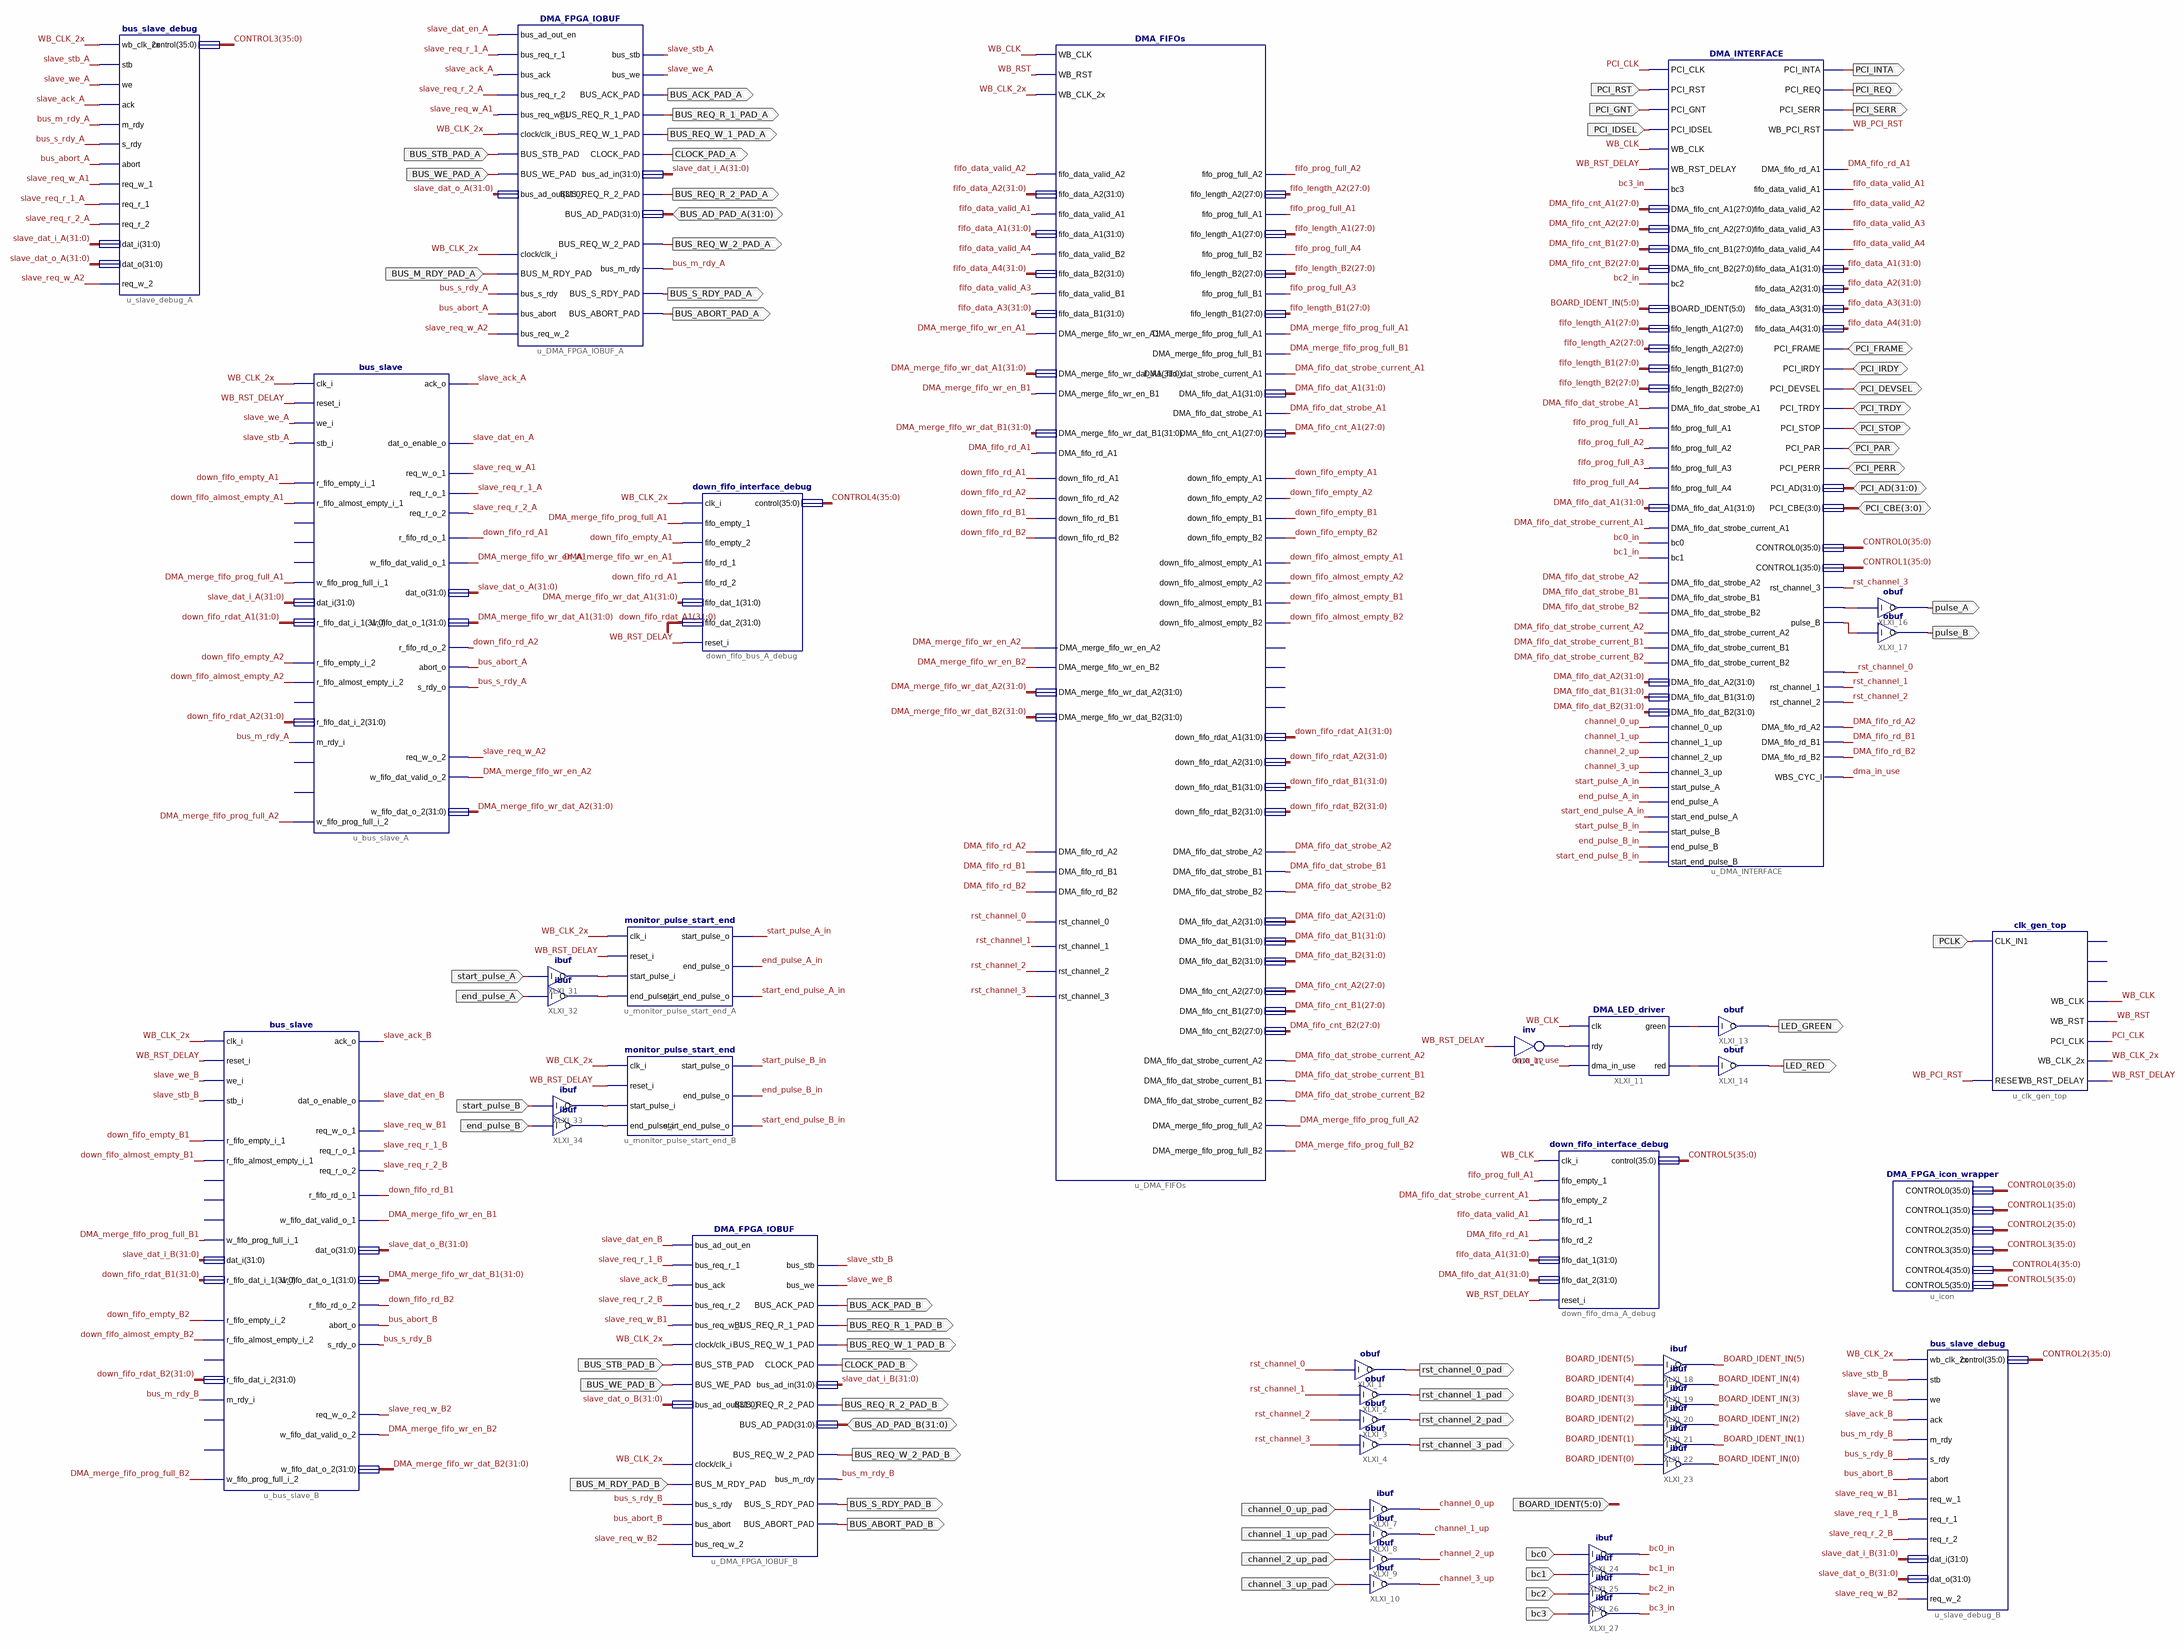
[diagram p0: schematic sheet 1]
// Xilinx ISE schematic DMA_FPGA.sch (spartan6) as structural Verilog: 42 symbols, 61 ports
module DMA_FPGA (
  input  BUS_STB_PAD_A,
  input  BUS_WE_PAD_A,
  input  BUS_M_RDY_PAD_A,
  input  BUS_STB_PAD_B,
  input  BUS_WE_PAD_B,
  input  BUS_M_RDY_PAD_B,
  input  PCI_RST,
  input  PCI_GNT,
  input  PCI_IDSEL,
  input  channel_0_up_pad,
  input  channel_1_up_pad,
  input  channel_2_up_pad,
  input  channel_3_up_pad,
  input  [5:0] BOARD_IDENT,
  input  bc0,
  input  bc1,
  input  bc2,
  input  bc3,
  input  PCLK,
  input  start_pulse_A,
  input  end_pulse_A,
  input  start_pulse_B,
  input  end_pulse_B,
  inout  [31:0] BUS_AD_PAD_A,
  inout  [31:0] BUS_AD_PAD_B,
  inout  PCI_FRAME,
  inout  PCI_IRDY,
  inout  PCI_DEVSEL,
  inout  PCI_TRDY,
  inout  PCI_STOP,
  inout  PCI_PAR,
  inout  PCI_PERR,
  inout  [31:0] PCI_AD,
  inout  [3:0] PCI_CBE,
  output BUS_ACK_PAD_A,
  output BUS_REQ_W_1_PAD_A,
  output CLOCK_PAD_A,
  output BUS_REQ_R_1_PAD_A,
  output BUS_REQ_R_2_PAD_A,
  output BUS_S_RDY_PAD_A,
  output BUS_ABORT_PAD_A,
  output BUS_ACK_PAD_B,
  output BUS_REQ_W_1_PAD_B,
  output CLOCK_PAD_B,
  output BUS_REQ_R_1_PAD_B,
  output BUS_REQ_R_2_PAD_B,
  output BUS_S_RDY_PAD_B,
  output BUS_ABORT_PAD_B,
  output BUS_REQ_W_2_PAD_A,
  output BUS_REQ_W_2_PAD_B,
  output PCI_INTA,
  output PCI_REQ,
  output PCI_SERR,
  output pulse_A,
  output pulse_B,
  output rst_channel_0_pad,
  output rst_channel_1_pad,
  output rst_channel_2_pad,
  output rst_channel_3_pad,
  output LED_GREEN,
  output LED_RED
);

  wire bc0_in, bc1_in, bc2_in, bc3_in, bus_abort_A, bus_abort_B, bus_m_rdy_A, bus_m_rdy_B, bus_s_rdy_A,
       bus_s_rdy_B, channel_0_up, channel_1_up, channel_2_up, channel_3_up, DMA_fifo_dat_strobe_A1,
       DMA_fifo_dat_strobe_A2, DMA_fifo_dat_strobe_B1, DMA_fifo_dat_strobe_B2,
       DMA_fifo_dat_strobe_current_A1, DMA_fifo_dat_strobe_current_A2, DMA_fifo_dat_strobe_current_B1,
       DMA_fifo_dat_strobe_current_B2, DMA_fifo_rd_A1, DMA_fifo_rd_A2, DMA_fifo_rd_B1, DMA_fifo_rd_B2,
       dma_in_use, DMA_merge_fifo_prog_full_A1, DMA_merge_fifo_prog_full_A2, DMA_merge_fifo_prog_full_B1,
       DMA_merge_fifo_prog_full_B2, DMA_merge_fifo_wr_en_A1, DMA_merge_fifo_wr_en_A2,
       DMA_merge_fifo_wr_en_B1, DMA_merge_fifo_wr_en_B2, down_fifo_almost_empty_A1,
       down_fifo_almost_empty_A2, down_fifo_almost_empty_B1, down_fifo_almost_empty_B2, down_fifo_empty_A1,
       down_fifo_empty_A2, down_fifo_empty_B1, down_fifo_empty_B2, down_fifo_rd_A1, down_fifo_rd_A2,
       down_fifo_rd_B1, down_fifo_rd_B2, end_pulse_A_in, end_pulse_B_in, fifo_data_valid_A1,
       fifo_data_valid_A2, fifo_data_valid_A3, fifo_data_valid_A4, fifo_prog_full_A1, fifo_prog_full_A2,
       fifo_prog_full_A3, fifo_prog_full_A4, LED_GREENX, PCI_CLK, rst_channel_0, rst_channel_1,
       rst_channel_2, rst_channel_3, slave_ack_A, slave_ack_B, slave_dat_en_A, slave_dat_en_B,
       slave_req_r_1_A, slave_req_r_1_B, slave_req_r_2_A, slave_req_r_2_B, slave_req_w_A1, slave_req_w_A2,
       slave_req_w_B1, slave_req_w_B2, slave_stb_A, slave_stb_B, slave_we_A, slave_we_B,
       start_end_pulse_A_in, start_end_pulse_B_in, start_pulse_A_in, start_pulse_B_in, WB_CLK, WB_CLK_2x,
       WB_PCI_RST, WB_RST, WB_RST_DELAY, XLXN_7, XLXN_11, XLXN_14, XLXN_15, XLXN_21, XLXN_23, XLXN_24,
       XLXN_25;
  wire [5:0] BOARD_IDENT_IN;
  wire [27:0] DMA_fifo_cnt_A1, DMA_fifo_cnt_A2, DMA_fifo_cnt_B1, DMA_fifo_cnt_B2, fifo_length_A1,
       fifo_length_A2, fifo_length_B1, fifo_length_B2;
  wire [31:0] DMA_fifo_dat_A1, DMA_fifo_dat_A2, DMA_fifo_dat_B1, DMA_fifo_dat_B2, DMA_merge_fifo_wr_dat_A1,
       DMA_merge_fifo_wr_dat_A2, DMA_merge_fifo_wr_dat_B1, DMA_merge_fifo_wr_dat_B2, down_fifo_rdat_A1,
       down_fifo_rdat_A2, down_fifo_rdat_B1, down_fifo_rdat_B2, fifo_data_A1, fifo_data_A2, fifo_data_A3,
       fifo_data_A4, slave_dat_i_A, slave_dat_i_B, slave_dat_o_A, slave_dat_o_B;
  wire [35:0] CONTROL0, CONTROL1, CONTROL2, CONTROL3, CONTROL4, CONTROL5;

  bus_slave u_bus_slave_A (
    .clk_i(WB_CLK_2x), .reset_i(WB_RST_DELAY), .we_i(slave_we_A), .stb_i(slave_stb_A),
    .r_fifo_empty_i_1(down_fifo_empty_A1), .r_fifo_almost_empty_i_1(down_fifo_almost_empty_A1),
    .w_fifo_prog_full_i_1(DMA_merge_fifo_prog_full_A1), .dat_i(slave_dat_i_A),
    .r_fifo_dat_i_1(down_fifo_rdat_A1), .ack_o(slave_ack_A), .dat_o_enable_o(slave_dat_en_A),
    .req_w_o_1(slave_req_w_A1), .w_fifo_dat_valid_o_1(DMA_merge_fifo_wr_en_A1), .dat_o(slave_dat_o_A),
    .w_fifo_dat_o_1(DMA_merge_fifo_wr_dat_A1), .req_r_o_1(slave_req_r_1_A), .req_r_o_2(slave_req_r_2_A),
    .r_fifo_rd_o_1(down_fifo_rd_A1), .r_fifo_rd_o_2(down_fifo_rd_A2), .r_fifo_empty_i_2(down_fifo_empty_A2),
    .r_fifo_almost_empty_i_2(down_fifo_almost_empty_A2), .r_fifo_dat_i_2(down_fifo_rdat_A2),
    .abort_o(bus_abort_A), .s_rdy_o(bus_s_rdy_A), .m_rdy_i(bus_m_rdy_A),
    .w_fifo_prog_full_i_2(DMA_merge_fifo_prog_full_A2), .w_fifo_dat_valid_o_2(DMA_merge_fifo_wr_en_A2),
    .w_fifo_dat_o_2(DMA_merge_fifo_wr_dat_A2), .req_w_o_2(slave_req_w_A2));  // open: r_fifo_prog_empty_i_1, w_fifo_full_i_1, w_fifo_almost_full_i_1, r_fifo_prog_empty_i_2, w_fifo_full_i_2, w_fifo_almost_full_i_2
  DMA_FPGA_IOBUF u_DMA_FPGA_IOBUF_A (
    .bus_ad_out_en(slave_dat_en_A), .bus_ack(slave_ack_A), .bus_req_w_1(slave_req_w_A1), .clock(WB_CLK_2x),
    .BUS_STB_PAD(BUS_STB_PAD_A), .BUS_WE_PAD(BUS_WE_PAD_A), .bus_ad_out(slave_dat_o_A),
    .bus_stb(slave_stb_A), .bus_we(slave_we_A), .BUS_ACK_PAD(BUS_ACK_PAD_A),
    .BUS_REQ_R_1_PAD(BUS_REQ_R_1_PAD_A), .BUS_REQ_W_1_PAD(BUS_REQ_W_1_PAD_A), .CLOCK_PAD(CLOCK_PAD_A),
    .bus_ad_in(slave_dat_i_A), .BUS_REQ_R_2_PAD(BUS_REQ_R_2_PAD_A), .BUS_AD_PAD(BUS_AD_PAD_A),
    .bus_req_r_1(slave_req_r_1_A), .bus_req_r_2(slave_req_r_2_A), .clk_i(WB_CLK_2x),
    .BUS_M_RDY_PAD(BUS_M_RDY_PAD_A), .bus_s_rdy(bus_s_rdy_A), .bus_abort(bus_abort_A),
    .bus_m_rdy(bus_m_rdy_A), .BUS_S_RDY_PAD(BUS_S_RDY_PAD_A), .BUS_ABORT_PAD(BUS_ABORT_PAD_A),
    .BUS_REQ_W_2_PAD(BUS_REQ_W_2_PAD_A), .bus_req_w_2(slave_req_w_A2));
  bus_slave_debug u_slave_debug_A (
    .wb_clk_2x(WB_CLK_2x), .stb(slave_stb_A), .we(slave_we_A), .ack(slave_ack_A), .m_rdy(bus_m_rdy_A),
    .s_rdy(bus_s_rdy_A), .abort(bus_abort_A), .req_w_1(slave_req_w_A1), .req_r_1(slave_req_r_1_A),
    .req_r_2(slave_req_r_2_A), .dat_i(slave_dat_i_A), .dat_o(slave_dat_o_A), .control(CONTROL3),
    .req_w_2(slave_req_w_A2));
  DMA_FIFOs u_DMA_FIFOs (
    .WB_CLK(WB_CLK), .WB_RST(WB_RST), .WB_CLK_2x(WB_CLK_2x), .fifo_data_valid_A2(fifo_data_valid_A2),
    .fifo_data_A2(fifo_data_A2), .fifo_data_valid_A1(fifo_data_valid_A1), .fifo_data_A1(fifo_data_A1),
    .fifo_data_valid_B2(fifo_data_valid_A4), .fifo_data_B2(fifo_data_A4),
    .fifo_data_valid_B1(fifo_data_valid_A3), .fifo_data_B1(fifo_data_A3),
    .DMA_merge_fifo_wr_en_A1(DMA_merge_fifo_wr_en_A1), .DMA_merge_fifo_wr_dat_A1(DMA_merge_fifo_wr_dat_A1),
    .DMA_merge_fifo_wr_en_B1(DMA_merge_fifo_wr_en_B1), .DMA_merge_fifo_wr_dat_B1(DMA_merge_fifo_wr_dat_B1),
    .DMA_fifo_rd_A1(DMA_fifo_rd_A1), .fifo_prog_full_A2(fifo_prog_full_A2), .fifo_length_A2(fifo_length_A2),
    .fifo_prog_full_A1(fifo_prog_full_A1), .fifo_length_A1(fifo_length_A1),
    .fifo_prog_full_B2(fifo_prog_full_A4), .fifo_length_B2(fifo_length_B2),
    .fifo_prog_full_B1(fifo_prog_full_A3), .fifo_length_B1(fifo_length_B1),
    .DMA_merge_fifo_prog_full_A1(DMA_merge_fifo_prog_full_A1),
    .DMA_merge_fifo_prog_full_B1(DMA_merge_fifo_prog_full_B1),
    .DMA_fifo_dat_strobe_current_A1(DMA_fifo_dat_strobe_current_A1), .DMA_fifo_dat_A1(DMA_fifo_dat_A1),
    .DMA_fifo_dat_strobe_A1(DMA_fifo_dat_strobe_A1), .DMA_fifo_cnt_A1(DMA_fifo_cnt_A1),
    .down_fifo_empty_A1(down_fifo_empty_A1), .down_fifo_empty_A2(down_fifo_empty_A2),
    .down_fifo_empty_B2(down_fifo_empty_B2), .down_fifo_almost_empty_A1(down_fifo_almost_empty_A1),
    .down_fifo_almost_empty_A2(down_fifo_almost_empty_A2),
    .down_fifo_almost_empty_B1(down_fifo_almost_empty_B1),
    .down_fifo_almost_empty_B2(down_fifo_almost_empty_B2), .down_fifo_empty_B1(down_fifo_empty_B1),
    .down_fifo_rdat_A1(down_fifo_rdat_A1), .down_fifo_rdat_A2(down_fifo_rdat_A2),
    .down_fifo_rdat_B1(down_fifo_rdat_B1), .down_fifo_rdat_B2(down_fifo_rdat_B2),
    .down_fifo_rd_A1(down_fifo_rd_A1), .down_fifo_rd_A2(down_fifo_rd_A2), .down_fifo_rd_B1(down_fifo_rd_B1),
    .down_fifo_rd_B2(down_fifo_rd_B2), .DMA_fifo_dat_strobe_A2(DMA_fifo_dat_strobe_A2),
    .DMA_fifo_dat_strobe_B1(DMA_fifo_dat_strobe_B1), .DMA_fifo_dat_strobe_B2(DMA_fifo_dat_strobe_B2),
    .DMA_fifo_dat_A2(DMA_fifo_dat_A2), .DMA_fifo_dat_B1(DMA_fifo_dat_B1), .DMA_fifo_dat_B2(DMA_fifo_dat_B2),
    .DMA_fifo_cnt_A2(DMA_fifo_cnt_A2), .DMA_fifo_cnt_B1(DMA_fifo_cnt_B1), .DMA_fifo_cnt_B2(DMA_fifo_cnt_B2),
    .DMA_fifo_dat_strobe_current_A2(DMA_fifo_dat_strobe_current_A2),
    .DMA_fifo_dat_strobe_current_B1(DMA_fifo_dat_strobe_current_B1),
    .DMA_fifo_dat_strobe_current_B2(DMA_fifo_dat_strobe_current_B2), .DMA_fifo_rd_A2(DMA_fifo_rd_A2),
    .DMA_fifo_rd_B1(DMA_fifo_rd_B1), .DMA_fifo_rd_B2(DMA_fifo_rd_B2),
    .DMA_merge_fifo_wr_en_A2(DMA_merge_fifo_wr_en_A2), .DMA_merge_fifo_wr_en_B2(DMA_merge_fifo_wr_en_B2),
    .DMA_merge_fifo_wr_dat_A2(DMA_merge_fifo_wr_dat_A2), .DMA_merge_fifo_wr_dat_B2(DMA_merge_fifo_wr_dat_B2),
    .DMA_merge_fifo_prog_full_A2(DMA_merge_fifo_prog_full_A2),
    .DMA_merge_fifo_prog_full_B2(DMA_merge_fifo_prog_full_B2), .rst_channel_0(rst_channel_0),
    .rst_channel_1(rst_channel_1), .rst_channel_2(rst_channel_2), .rst_channel_3(rst_channel_3));  // open: down_fifo_prog_empty_A1, down_fifo_prog_empty_A2, down_fifo_prog_empty_B1, down_fifo_prog_empty_B2
  DMA_FPGA_IOBUF u_DMA_FPGA_IOBUF_B (
    .bus_ad_out_en(slave_dat_en_B), .bus_ack(slave_ack_B), .bus_req_w_1(slave_req_w_B1), .clock(WB_CLK_2x),
    .BUS_STB_PAD(BUS_STB_PAD_B), .BUS_WE_PAD(BUS_WE_PAD_B), .bus_ad_out(slave_dat_o_B),
    .bus_stb(slave_stb_B), .bus_we(slave_we_B), .BUS_ACK_PAD(BUS_ACK_PAD_B),
    .BUS_REQ_R_1_PAD(BUS_REQ_R_1_PAD_B), .BUS_REQ_W_1_PAD(BUS_REQ_W_1_PAD_B), .CLOCK_PAD(CLOCK_PAD_B),
    .bus_ad_in(slave_dat_i_B), .BUS_REQ_R_2_PAD(BUS_REQ_R_2_PAD_B), .BUS_AD_PAD(BUS_AD_PAD_B),
    .bus_req_r_1(slave_req_r_1_B), .bus_req_r_2(slave_req_r_2_B), .clk_i(WB_CLK_2x),
    .BUS_M_RDY_PAD(BUS_M_RDY_PAD_B), .bus_s_rdy(bus_s_rdy_B), .bus_abort(bus_abort_B),
    .bus_m_rdy(bus_m_rdy_B), .BUS_S_RDY_PAD(BUS_S_RDY_PAD_B), .BUS_ABORT_PAD(BUS_ABORT_PAD_B),
    .BUS_REQ_W_2_PAD(BUS_REQ_W_2_PAD_B), .bus_req_w_2(slave_req_w_B2));
  bus_slave u_bus_slave_B (
    .clk_i(WB_CLK_2x), .reset_i(WB_RST_DELAY), .we_i(slave_we_B), .stb_i(slave_stb_B),
    .r_fifo_empty_i_1(down_fifo_empty_B1), .r_fifo_almost_empty_i_1(down_fifo_almost_empty_B1),
    .w_fifo_prog_full_i_1(DMA_merge_fifo_prog_full_B1), .dat_i(slave_dat_i_B),
    .r_fifo_dat_i_1(down_fifo_rdat_B1), .ack_o(slave_ack_B), .dat_o_enable_o(slave_dat_en_B),
    .req_w_o_1(slave_req_w_B1), .w_fifo_dat_valid_o_1(DMA_merge_fifo_wr_en_B1), .dat_o(slave_dat_o_B),
    .w_fifo_dat_o_1(DMA_merge_fifo_wr_dat_B1), .req_r_o_1(slave_req_r_1_B), .req_r_o_2(slave_req_r_2_B),
    .r_fifo_rd_o_1(down_fifo_rd_B1), .r_fifo_rd_o_2(down_fifo_rd_B2), .r_fifo_empty_i_2(down_fifo_empty_B2),
    .r_fifo_almost_empty_i_2(down_fifo_almost_empty_B2), .r_fifo_dat_i_2(down_fifo_rdat_B2),
    .abort_o(bus_abort_B), .s_rdy_o(bus_s_rdy_B), .m_rdy_i(bus_m_rdy_B),
    .w_fifo_prog_full_i_2(DMA_merge_fifo_prog_full_B2), .w_fifo_dat_valid_o_2(DMA_merge_fifo_wr_en_B2),
    .w_fifo_dat_o_2(DMA_merge_fifo_wr_dat_B2), .req_w_o_2(slave_req_w_B2));  // open: r_fifo_prog_empty_i_1, w_fifo_full_i_1, w_fifo_almost_full_i_1, r_fifo_prog_empty_i_2, w_fifo_full_i_2, w_fifo_almost_full_i_2
  down_fifo_interface_debug down_fifo_bus_A_debug (
    .clk_i(WB_CLK_2x), .fifo_empty_1(DMA_merge_fifo_prog_full_A1), .fifo_empty_2(down_fifo_empty_A1),
    .fifo_rd_1(DMA_merge_fifo_wr_en_A1), .fifo_rd_2(down_fifo_rd_A1), .fifo_dat_1(DMA_merge_fifo_wr_dat_A1),
    .fifo_dat_2(down_fifo_rdat_A1), .control(CONTROL4), .reset_i(WB_RST_DELAY));
  bus_slave_debug u_slave_debug_B (
    .wb_clk_2x(WB_CLK_2x), .stb(slave_stb_B), .we(slave_we_B), .ack(slave_ack_B), .m_rdy(bus_m_rdy_B),
    .s_rdy(bus_s_rdy_B), .abort(bus_abort_B), .req_w_1(slave_req_w_B1), .req_r_1(slave_req_r_1_B),
    .req_r_2(slave_req_r_2_B), .dat_i(slave_dat_i_B), .dat_o(slave_dat_o_B), .control(CONTROL2),
    .req_w_2(slave_req_w_B2));
  DMA_FPGA_icon_wrapper u_icon (
    .CONTROL0(CONTROL0), .CONTROL1(CONTROL1), .CONTROL2(CONTROL2), .CONTROL3(CONTROL3), .CONTROL5(CONTROL5),
    .CONTROL4(CONTROL4));
  DMA_INTERFACE u_DMA_INTERFACE (
    .PCI_CLK(PCI_CLK), .PCI_RST(PCI_RST), .PCI_GNT(PCI_GNT), .PCI_IDSEL(PCI_IDSEL), .WB_CLK(WB_CLK),
    .WB_RST_DELAY(WB_RST_DELAY), .DMA_fifo_cnt_A1(DMA_fifo_cnt_A1), .BOARD_IDENT(BOARD_IDENT_IN),
    .fifo_length_A1(fifo_length_A1), .fifo_length_A2(fifo_length_A2), .fifo_length_B1(fifo_length_B1),
    .fifo_length_B2(fifo_length_B2), .DMA_fifo_dat_strobe_A1(DMA_fifo_dat_strobe_A1),
    .fifo_prog_full_A1(fifo_prog_full_A1), .fifo_prog_full_A2(fifo_prog_full_A2),
    .fifo_prog_full_A3(fifo_prog_full_A3), .fifo_prog_full_A4(fifo_prog_full_A4),
    .DMA_fifo_dat_A1(DMA_fifo_dat_A1), .DMA_fifo_dat_strobe_current_A1(DMA_fifo_dat_strobe_current_A1),
    .PCI_FRAME(PCI_FRAME), .PCI_IRDY(PCI_IRDY), .PCI_DEVSEL(PCI_DEVSEL), .PCI_TRDY(PCI_TRDY),
    .PCI_STOP(PCI_STOP), .PCI_PAR(PCI_PAR), .PCI_PERR(PCI_PERR), .PCI_AD(PCI_AD), .PCI_CBE(PCI_CBE),
    .PCI_INTA(PCI_INTA), .PCI_REQ(PCI_REQ), .PCI_SERR(PCI_SERR), .WB_PCI_RST(WB_PCI_RST),
    .DMA_fifo_rd_A1(DMA_fifo_rd_A1), .fifo_data_valid_A1(fifo_data_valid_A1),
    .fifo_data_valid_A2(fifo_data_valid_A2), .fifo_data_valid_A3(fifo_data_valid_A3),
    .fifo_data_valid_A4(fifo_data_valid_A4), .fifo_data_A1(fifo_data_A1), .fifo_data_A2(fifo_data_A2),
    .fifo_data_A3(fifo_data_A3), .fifo_data_A4(fifo_data_A4), .CONTROL0(CONTROL0), .CONTROL1(CONTROL1),
    .DMA_fifo_cnt_A2(DMA_fifo_cnt_A2), .DMA_fifo_cnt_B1(DMA_fifo_cnt_B1), .DMA_fifo_cnt_B2(DMA_fifo_cnt_B2),
    .DMA_fifo_dat_strobe_A2(DMA_fifo_dat_strobe_A2), .DMA_fifo_dat_strobe_B1(DMA_fifo_dat_strobe_B1),
    .DMA_fifo_dat_strobe_B2(DMA_fifo_dat_strobe_B2),
    .DMA_fifo_dat_strobe_current_A2(DMA_fifo_dat_strobe_current_A2),
    .DMA_fifo_dat_strobe_current_B1(DMA_fifo_dat_strobe_current_B1),
    .DMA_fifo_dat_strobe_current_B2(DMA_fifo_dat_strobe_current_B2), .DMA_fifo_dat_A2(DMA_fifo_dat_A2),
    .DMA_fifo_dat_B1(DMA_fifo_dat_B1), .DMA_fifo_dat_B2(DMA_fifo_dat_B2), .DMA_fifo_rd_A2(DMA_fifo_rd_A2),
    .DMA_fifo_rd_B1(DMA_fifo_rd_B1), .DMA_fifo_rd_B2(DMA_fifo_rd_B2), .rst_channel_0(rst_channel_0),
    .rst_channel_1(rst_channel_1), .rst_channel_2(rst_channel_2), .rst_channel_3(rst_channel_3),
    .channel_0_up(channel_0_up), .channel_1_up(channel_1_up), .channel_2_up(channel_2_up),
    .channel_3_up(channel_3_up), .WBS_CYC_I(dma_in_use), .pulse_A(XLXN_14), .pulse_B(XLXN_15), .bc0(bc0_in),
    .bc1(bc1_in), .bc2(bc2_in), .bc3(bc3_in), .start_pulse_A(start_pulse_A_in), .end_pulse_A(end_pulse_A_in),
    .start_end_pulse_A(start_end_pulse_A_in), .start_pulse_B(start_pulse_B_in), .end_pulse_B(end_pulse_B_in),
    .start_end_pulse_B(start_end_pulse_B_in));
  obuf XLXI_17 (.I(XLXN_15), .O(pulse_B));
  obuf XLXI_16 (.I(XLXN_14), .O(pulse_A));
  obuf XLXI_1 (.I(rst_channel_0), .O(rst_channel_0_pad));
  obuf XLXI_2 (.I(rst_channel_1), .O(rst_channel_1_pad));
  obuf XLXI_3 (.I(rst_channel_2), .O(rst_channel_2_pad));
  obuf XLXI_4 (.I(rst_channel_3), .O(rst_channel_3_pad));
  ibuf XLXI_8 (.I(channel_1_up_pad), .O(channel_1_up));
  ibuf XLXI_9 (.I(channel_2_up_pad), .O(channel_2_up));
  ibuf XLXI_10 (.I(channel_3_up_pad), .O(channel_3_up));
  ibuf XLXI_7 (.I(channel_0_up_pad), .O(channel_0_up));
  ibuf XLXI_18 (.I(BOARD_IDENT[5]), .O(BOARD_IDENT_IN[5]));
  ibuf XLXI_19 (.I(BOARD_IDENT[4]), .O(BOARD_IDENT_IN[4]));
  ibuf XLXI_20 (.I(BOARD_IDENT[3]), .O(BOARD_IDENT_IN[3]));
  ibuf XLXI_21 (.I(BOARD_IDENT[2]), .O(BOARD_IDENT_IN[2]));
  ibuf XLXI_22 (.I(BOARD_IDENT[1]), .O(BOARD_IDENT_IN[1]));
  ibuf XLXI_23 (.I(BOARD_IDENT[0]), .O(BOARD_IDENT_IN[0]));
  ibuf XLXI_24 (.I(bc0), .O(bc0_in));
  ibuf XLXI_25 (.I(bc1), .O(bc1_in));
  ibuf XLXI_26 (.I(bc2), .O(bc2_in));
  ibuf XLXI_27 (.I(bc3), .O(bc3_in));
  down_fifo_interface_debug down_fifo_dma_A_debug (
    .clk_i(WB_CLK), .fifo_empty_1(fifo_prog_full_A1), .fifo_empty_2(DMA_fifo_dat_strobe_current_A1),
    .fifo_rd_1(fifo_data_valid_A1), .fifo_rd_2(DMA_fifo_rd_A1), .fifo_dat_1(fifo_data_A1),
    .fifo_dat_2(DMA_fifo_dat_A1), .control(CONTROL5), .reset_i(WB_RST_DELAY));
  clk_gen_top u_clk_gen_top (
    .CLK_IN1(PCLK), .RESET(WB_PCI_RST), .WB_CLK(WB_CLK), .WB_RST(WB_RST), .PCI_CLK(PCI_CLK),
    .WB_CLK_2x(WB_CLK_2x), .WB_RST_DELAY(WB_RST_DELAY));  // open: CLK_OUT1, CLK_OUT2, LOCKED
  DMA_LED_driver XLXI_11 (.clk(WB_CLK), .rdy(XLXN_7), .dma_in_use(dma_in_use), .green(LED_GREENX), .red(XLXN_11));
  not XLXI_12 (XLXN_7, WB_RST_DELAY);
  obuf XLXI_13 (.I(LED_GREENX), .O(LED_GREEN));
  obuf XLXI_14 (.I(XLXN_11), .O(LED_RED));
  monitor_pulse_start_end u_monitor_pulse_start_end_A (
    .clk_i(WB_CLK_2x), .reset_i(WB_RST_DELAY), .start_pulse_i(XLXN_21), .end_pulse_i(XLXN_23),
    .start_pulse_o(start_pulse_A_in), .end_pulse_o(end_pulse_A_in), .start_end_pulse_o(start_end_pulse_A_in));
  monitor_pulse_start_end u_monitor_pulse_start_end_B (
    .clk_i(WB_CLK_2x), .reset_i(WB_RST_DELAY), .start_pulse_i(XLXN_24), .end_pulse_i(XLXN_25),
    .start_pulse_o(start_pulse_B_in), .end_pulse_o(end_pulse_B_in), .start_end_pulse_o(start_end_pulse_B_in));
  ibuf XLXI_31 (.I(start_pulse_A), .O(XLXN_21));
  ibuf XLXI_32 (.I(end_pulse_A), .O(XLXN_23));
  ibuf XLXI_33 (.I(start_pulse_B), .O(XLXN_24));
  ibuf XLXI_34 (.I(end_pulse_B), .O(XLXN_25));
endmodule
